# Altium schematic sheet Communications.SchDoc
size A4
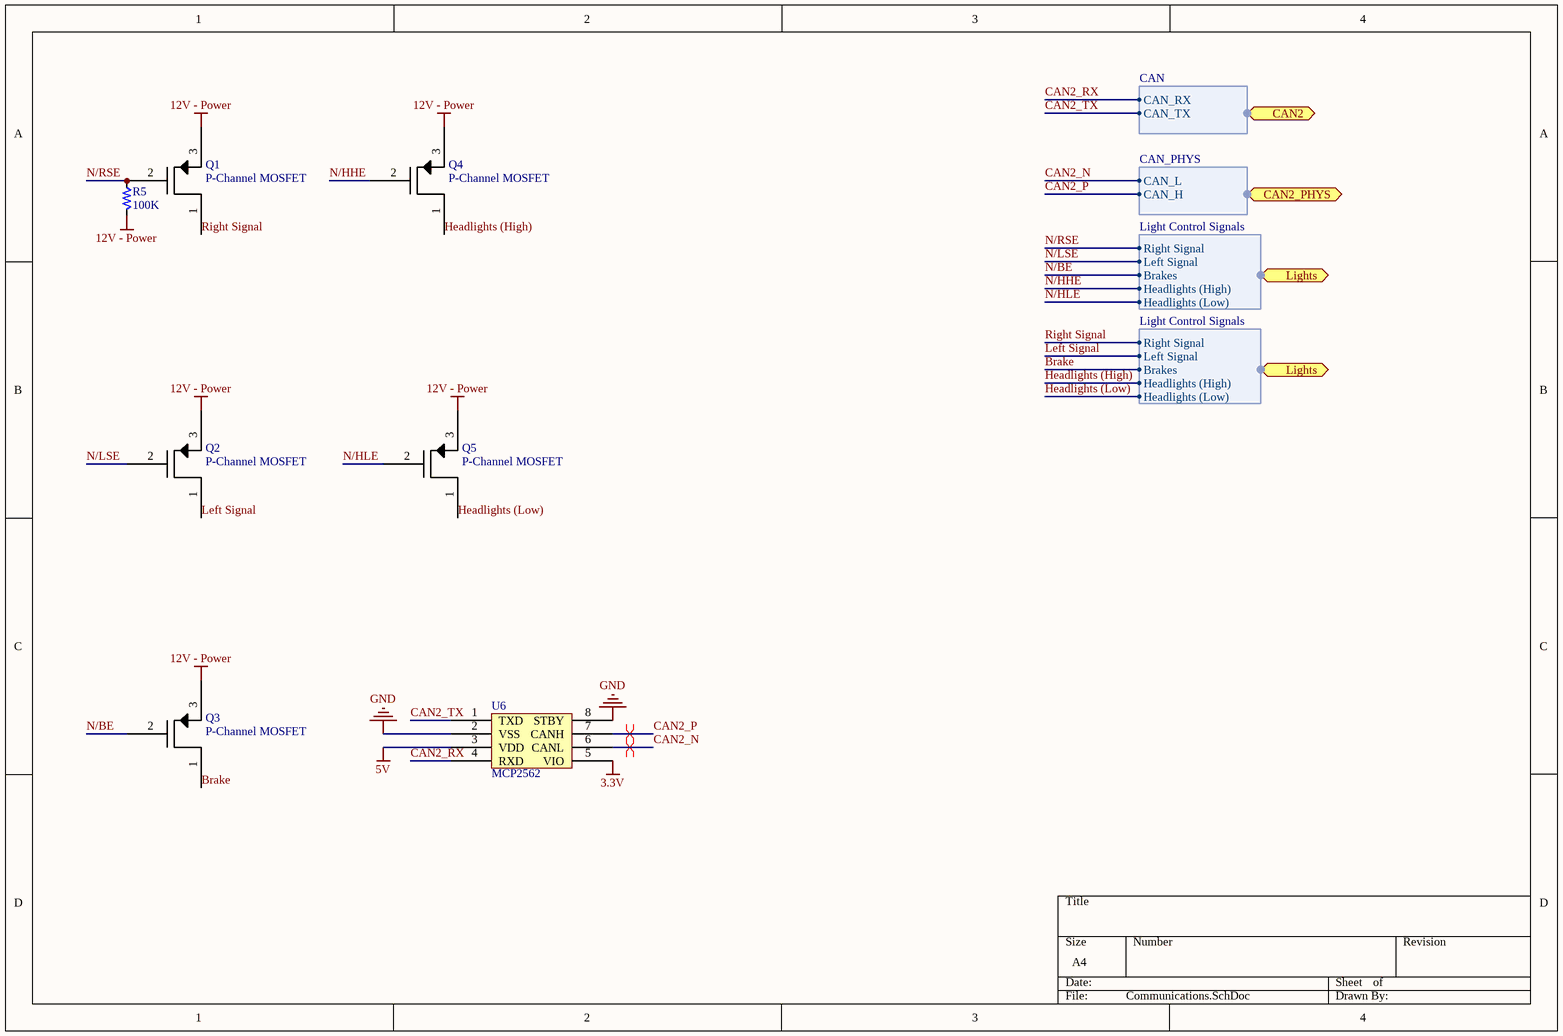
[diagram p0: Communications.SchDoc]

## Parts
Q1  P-Channel MOSFET  [FDD6637 PMOS - DPAK]
Q2  P-Channel MOSFET  [FDD6637 PMOS - DPAK]
Q3  P-Channel MOSFET  [FDD6637 PMOS - DPAK]
Q4  P-Channel MOSFET  [FDD6637 PMOS - DPAK]
Q5  P-Channel MOSFET  [FDD6637 PMOS - DPAK]
R5  Resistance: 100K  [PCB_GENERIC_SMD_0603]  (hidden comment: SCH_GENERIC_RESISTOR_0603)
U6  MCP2562  [MCP2562]

## Ports
CAN2 (harness CAN), CAN2_PHYS (harness CAN_PHYS), Lights (harness Light Control Signals)

## Harnesses
CAN_PHYS: CAN_L, CAN_H
CAN: CAN_RX, CAN_TX
Light Control Signals: Right Signal, Left Signal, Brakes, Headlights (Low), Headlights (High)

## Nets
3.3V: U6.5(VIO)
5V: U6.3(VDD)
12V - Power: Q1.3 Q2.3 Q3.3 Q4.3 Q5.3 R5.2
GND: U6.2(VSS) U6.8(STBY)
Brake: Q3.1 Q3.2 ; port Lights.Brakes  [also labelled N/BE]
CAN2_N: U6.6(CANL) ; port CAN2_PHYS.CAN_L
CAN2_P: U6.7(CANH) ; port CAN2_PHYS.CAN_H
CAN2_RX: U6.4(RXD) ; port CAN2.CAN_RX
CAN2_TX: U6.1(TXD) ; port CAN2.CAN_TX
Headlights (High): Q4.1 Q4.2 ; port Lights.Headlights (High)  [also labelled N/HHE]
Headlights (Low): Q5.1 Q5.2 ; port Lights.Headlights (Low)  [also labelled N/HLE]
Left Signal: Q2.1 Q2.2 ; port Lights.Left Signal  [also labelled N/LSE]
N/RSE: Q1.1 Q1.2 R5.1 ; port Lights.Right Signal  [also labelled Right Signal]

## Layout directives
differential pair: CAN2_N, CAN2_P

## Library data of the parts
R5 = SCH_GENERIC_RESISTOR_0603: Generic SMD resistor 0603